# EAGLE schematic airlight (EAGLE 6.4)

## Sheet 1 of 3
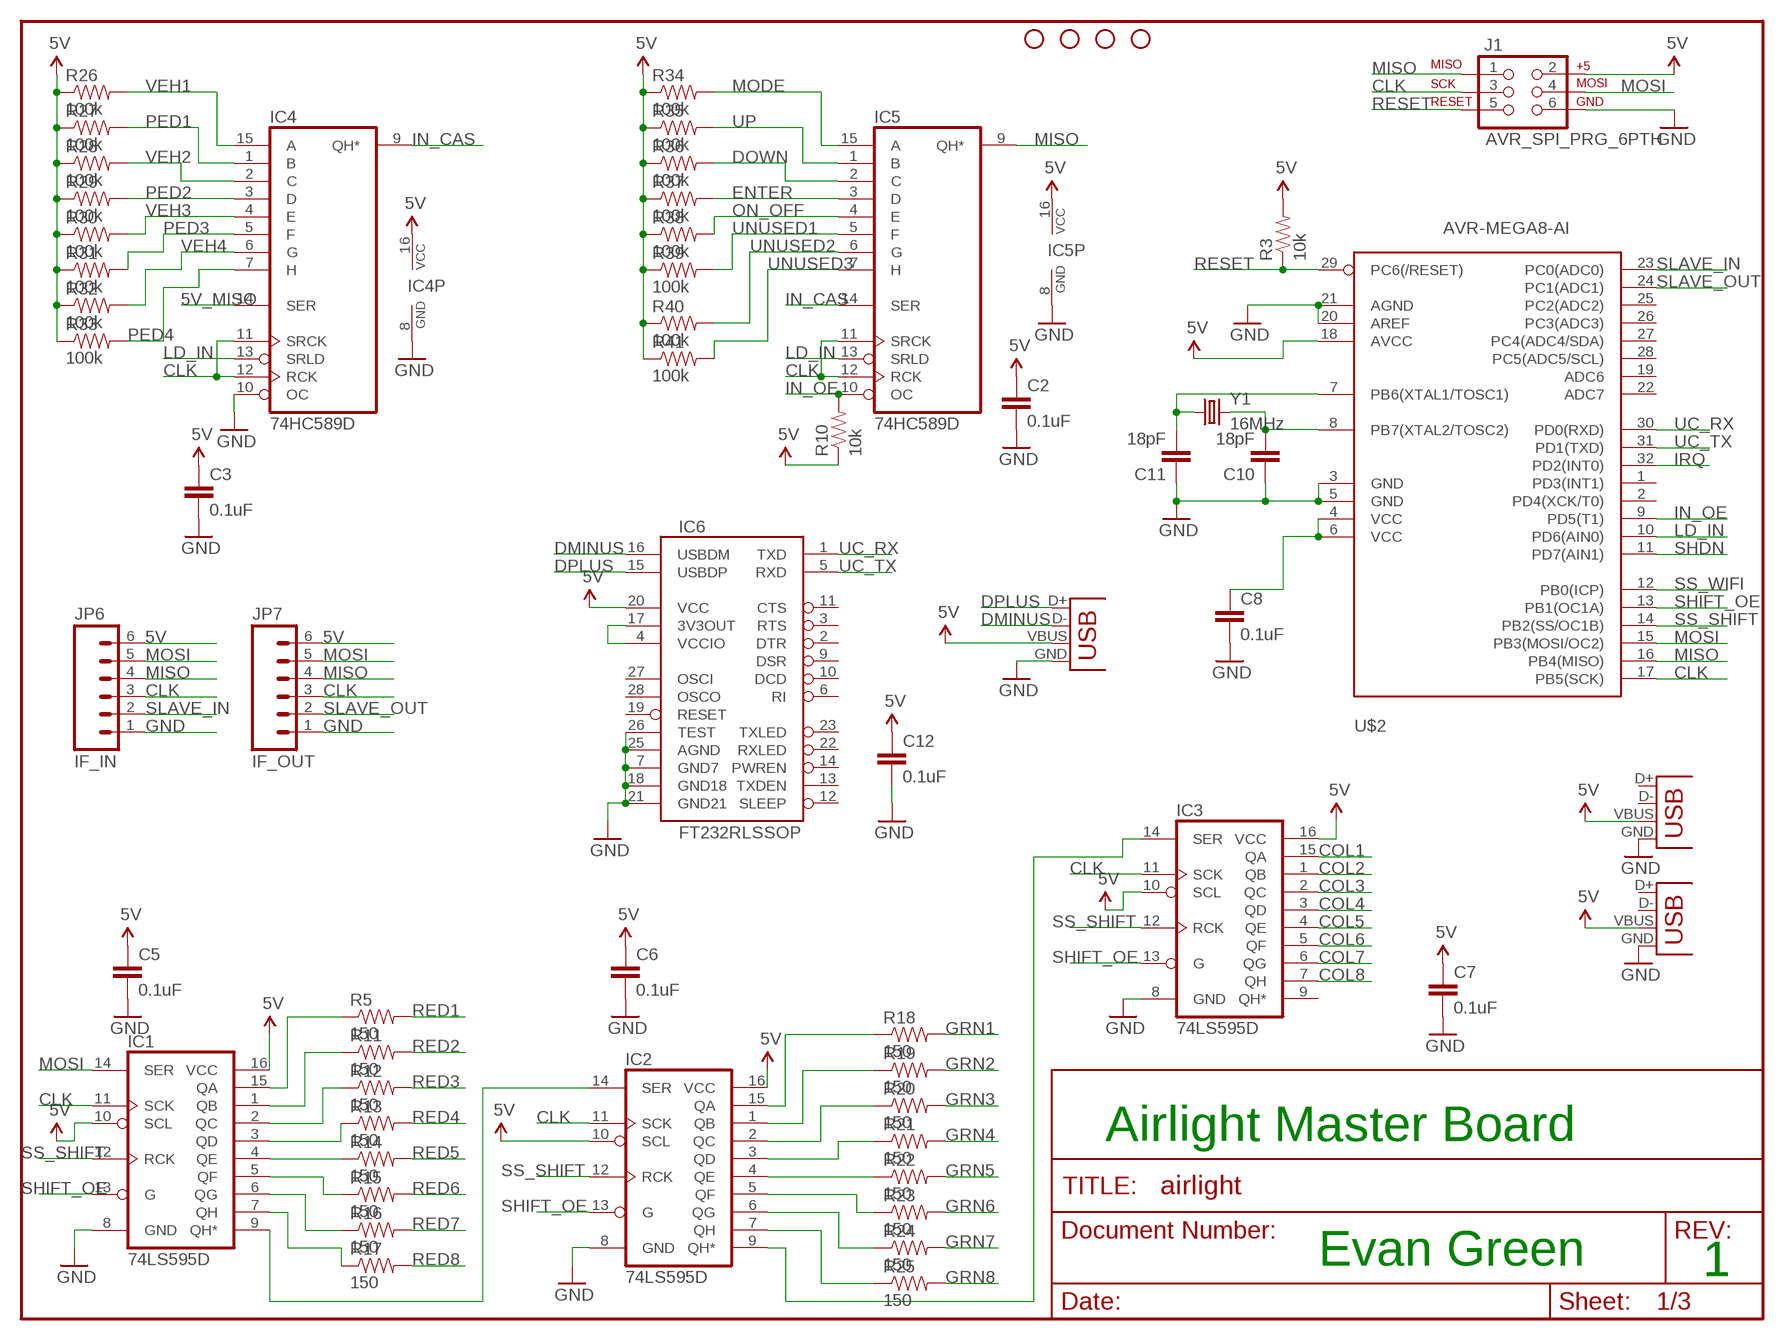
[diagram p0: schematic, sheet 1]

### Parts
C2  0.1uF  CAP0402-CAP  [0402-CAP]
C3  0.1uF  CAP0402-CAP  [0402-CAP]
C5  0.1uF  CAP0402-CAP  [0402-CAP]
C6  0.1uF  CAP0402-CAP  [0402-CAP]
C7  0.1uF  CAP0402-CAP  [0402-CAP]
C8  0.1uF  CAP0402-CAP  [0402-CAP]
C10  18pF  CAP0402-CAP  [0402-CAP]
C11  18pF  CAP0402-CAP  [0402-CAP]
C12  0.1uF  CAP0402-CAP  [0402-CAP]
IC1  74LS595D  [SO16]
IC2  74LS595D  [SO16]
IC3  74LS595D  [SO16]
IC4  74HC589D  [SO16]
IC5  74HC589D  [SO16]
IC6  FT232RLSSOP  [SSOP28DB]
J1  AVR_SPI_PRG_6PTH  [2X3]
JP2  STAND-OFF  [STAND-OFF]
JP3  STAND-OFF  [STAND-OFF]
JP4  STAND-OFF  [STAND-OFF]
JP5  STAND-OFF  [STAND-OFF]
JP6  IF_IN  M06SIP  [1X06]
JP7  IF_OUT  M06SIP  [1X06]
R3  10k  RESISTOR0402-RES  [0402-RES]
R5  150  RESISTOR0402-RES  [0402-RES]
R10  10k  RESISTOR0402-RES  [0402-RES]
R11  150  RESISTOR0402-RES  [0402-RES]
R12  150  RESISTOR0402-RES  [0402-RES]
R13  150  RESISTOR0402-RES  [0402-RES]
R14  150  RESISTOR0402-RES  [0402-RES]
R15  150  RESISTOR0402-RES  [0402-RES]
R16  150  RESISTOR0402-RES  [0402-RES]
R17  150  RESISTOR0402-RES  [0402-RES]
R18  150  RESISTOR0402-RES  [0402-RES]
R19  150  RESISTOR0402-RES  [0402-RES]
R20  150  RESISTOR0402-RES  [0402-RES]
R21  150  RESISTOR0402-RES  [0402-RES]
R22  150  RESISTOR0402-RES  [0402-RES]
R23  150  RESISTOR0402-RES  [0402-RES]
R24  150  RESISTOR0402-RES  [0402-RES]
R25  150  RESISTOR0402-RES  [0402-RES]
R26  100k  RESISTOR0402-RES  [0402-RES]
R27  100k  RESISTOR0402-RES  [0402-RES]
R28  100k  RESISTOR0402-RES  [0402-RES]
R29  100k  RESISTOR0402-RES  [0402-RES]
R30  100k  RESISTOR0402-RES  [0402-RES]
R31  100k  RESISTOR0402-RES  [0402-RES]
R32  100k  RESISTOR0402-RES  [0402-RES]
R33  100k  RESISTOR0402-RES  [0402-RES]
R34  100k  RESISTOR0402-RES  [0402-RES]
R35  100k  RESISTOR0402-RES  [0402-RES]
R36  100k  RESISTOR0402-RES  [0402-RES]
R37  100k  RESISTOR0402-RES  [0402-RES]
R38  100k  RESISTOR0402-RES  [0402-RES]
R39  100k  RESISTOR0402-RES  [0402-RES]
R40  100k  RESISTOR0402-RES  [0402-RES]
R41  100k  RESISTOR0402-RES  [0402-RES]
U$2  AVR-MEGA8-AI  [TQFP32-08]
X1  USBSMD  [USB-MINIB]
X2  USBSMD  [USB-MINIB]
X3  USBSMD  [USB-MINIB]
Y1  16MHz  CRYSTALHC49US  [HC49US]

### Nets
5V: C2.1 C3.1 C5.1 C6.1 C7.1 C12.1 IC1.10(SCL) IC1.16(VCC) IC2.10(SCL) IC2.16(VCC) IC3.10(SCL) IC3.16(VCC) IC4.16(VCC) IC5.16(VCC) IC6.20(VCC) J1.2 JP6.6 JP7.6 R3.2 R10.1 R26.1 R27.1 R28.1 R29.1 R30.1 R31.1 R32.1 R33.1 R34.1 R35.1 R36.1 R37.1 R38.1 R39.1 R40.1 R41.1 U$2.18(AVCC) X1.VBUS X2.VBUS X3.VBUS ; also sheet 3
5V_MISO: IC4.14(SER) ; also sheet 3
CLK: IC1.11(SCK) IC2.11(SCK) IC3.11(SCK) IC4.11(SRCK) IC4.12(RCK) IC5.11(SRCK) IC5.12(RCK) J1.3 JP6.3 JP7.3 U$2.17(PB5(SCK)) ; also sheet 3
COL1: IC3.15(QA) ; also sheet 2
COL2: IC3.1(QB) ; also sheet 2
COL3: IC3.2(QC) ; also sheet 2
COL4: IC3.3(QD) ; also sheet 2
COL5: IC3.4(QE) ; also sheet 2
COL6: IC3.5(QF) ; also sheet 2
COL7: IC3.6(QG) ; also sheet 2
COL8: IC3.7(QH) ; also sheet 2
DMINUS: IC6.16(USBDM) X1.D-
DOWN: IC5.2(C) R36.2 ; also sheet 3
DPLUS: IC6.15(USBDP) X1.D+
ENTER: IC5.3(D) R37.2 ; also sheet 3
GND: C2.2 C3.2 C5.2 C6.2 C7.2 C8.2 C10.1 C11.1 C12.2 IC1.8(GND) IC2.8(GND) IC3.8(GND) IC4.8(GND) IC4.10(OC) IC5.8(GND) IC6.7(GND7) IC6.18(GND18) IC6.21(GND21) IC6.25(AGND) IC6.26(TEST) J1.6 JP6.1 JP7.1 U$2.3(GND) U$2.5(GND) U$2.20(AREF) U$2.21(AGND) X1.GND X2.GND X3.GND ; also sheet 3
GRN1: R18.2 ; also sheet 2
GRN2: R19.2 ; also sheet 2
GRN3: R20.2 ; also sheet 2
GRN4: R21.2 ; also sheet 2
GRN5: R22.2 ; also sheet 2
GRN6: R23.2 ; also sheet 2
GRN7: R24.2 ; also sheet 2
GRN8: R25.2 ; also sheet 2
IN_CAS: IC4.9(QH*) IC5.14(SER)
IN_OE: IC5.10(OC) R10.2 U$2.9(PD5(T1))
IRQ: U$2.32(PD2(INT0)) ; also sheet 3
LD_IN: IC4.13(SRLD) IC5.13(SRLD) U$2.10(PD6(AIN0))
MISO: IC5.9(QH*) J1.1 JP6.4 JP7.4 U$2.16(PB4(MISO))
MODE: IC5.15(A) R34.2 ; also sheet 3
MOSI: IC1.14(SER) J1.4 JP6.5 JP7.5 U$2.15(PB3(MOSI/OC2)) ; also sheet 3
N$1: IC1.15(QA) R5.1
N$2: IC1.1(QB) R11.1
N$3: IC1.2(QC) R12.1
N$4: IC1.3(QD) R13.1
N$5: IC1.4(QE) R14.1
N$6: IC1.5(QF) R15.1
N$7: IC1.6(QG) R16.1
N$8: IC1.7(QH) R17.1
N$11: C11.2 U$2.7(PB6(XTAL1/TOSC1)) Y1.1
N$12: C10.2 U$2.8(PB7(XTAL2/TOSC2)) Y1.2
N$13: IC2.15(QA) R18.1
N$14: IC2.1(QB) R19.1
N$15: IC2.2(QC) R20.1
N$16: IC2.3(QD) R21.1
N$17: IC2.4(QE) R22.1
N$18: IC2.5(QF) R23.1
N$19: IC2.6(QG) R24.1
N$20: IC2.7(QH) R25.1
N$21: IC6.4(VCCIO) IC6.17(3V3OUT)
N$27: IC2.9(QH*) IC3.14(SER)
N$31: C8.1 U$2.4(VCC) U$2.6(VCC)
N$32: IC1.9(QH*) IC2.14(SER)
ON_OFF: IC5.4(E) R38.2 ; also sheet 3
PED1: IC4.1(B) R27.2 ; also sheet 3
PED2: IC4.3(D) R29.2 ; also sheet 3
PED3: IC4.5(F) R31.2 ; also sheet 3
PED4: IC4.7(H) R33.2 ; also sheet 3
RED1: R5.2 ; also sheet 2
RED2: R11.2 ; also sheet 2
RED3: R12.2 ; also sheet 2
RED4: R13.2 ; also sheet 2
RED5: R14.2 ; also sheet 2
RED6: R15.2 ; also sheet 2
RED7: R16.2 ; also sheet 2
RED8: R17.2 ; also sheet 2
RESET: J1.5 R3.1 U$2.29(PC6(/RESET))
SHDN: U$2.11(PD7(AIN1)) ; also sheet 3
SHIFT_OE: IC1.13(G) IC2.13(G) IC3.13(G) U$2.13(PB1(OC1A))
SLAVE_IN: JP6.2 U$2.23(PC0(ADC0))
SLAVE_OUT: JP7.2 U$2.24(PC1(ADC1))
SS_SHIFT: IC1.12(RCK) IC2.12(RCK) IC3.12(RCK) U$2.14(PB2(SS/OC1B))
SS_WIFI: U$2.12(PB0(ICP)) ; also sheet 3
UC_RX: IC6.1(TXD) U$2.30(PD0(RXD))
UC_TX: IC6.5(RXD) U$2.31(PD1(TXD))
UNUSED1: IC5.5(F) R39.2
UNUSED2: IC5.6(G) R40.2
UNUSED3: IC5.7(H) R41.2
UP: IC5.1(B) R35.2 ; also sheet 3
VEH1: IC4.15(A) R26.2 ; also sheet 3
VEH2: IC4.2(C) R28.2 ; also sheet 3
VEH3: IC4.4(E) R30.2 ; also sheet 3
VEH4: IC4.6(G) R32.2 ; also sheet 3
Unconnected: IC3.9(QH*) IC6.2(DTR) IC6.3(RTS) IC6.6(RI) IC6.9(DSR) IC6.10(DCD) IC6.11(CTS) IC6.12(SLEEP) IC6.13(TXDEN) IC6.14(PWREN) IC6.19(RESET) IC6.22(RXLED) IC6.23(TXLED) IC6.27(OSCI) IC6.28(OSCO) U$2.1(PD3(INT1)) U$2.2(PD4(XCK/T0)) U$2.19(ADC6) U$2.22(ADC7) U$2.25(PC2(ADC2)) U$2.26(PC3(ADC3)) U$2.27(PC4(ADC4/SDA)) U$2.28(PC5(ADC5/SCL)) X2.D+ X2.D- X3.D+ X3.D-

### Notes on the sheet
- Airlight Master Board
- Evan Green | 1

## Sheet 2 of 3
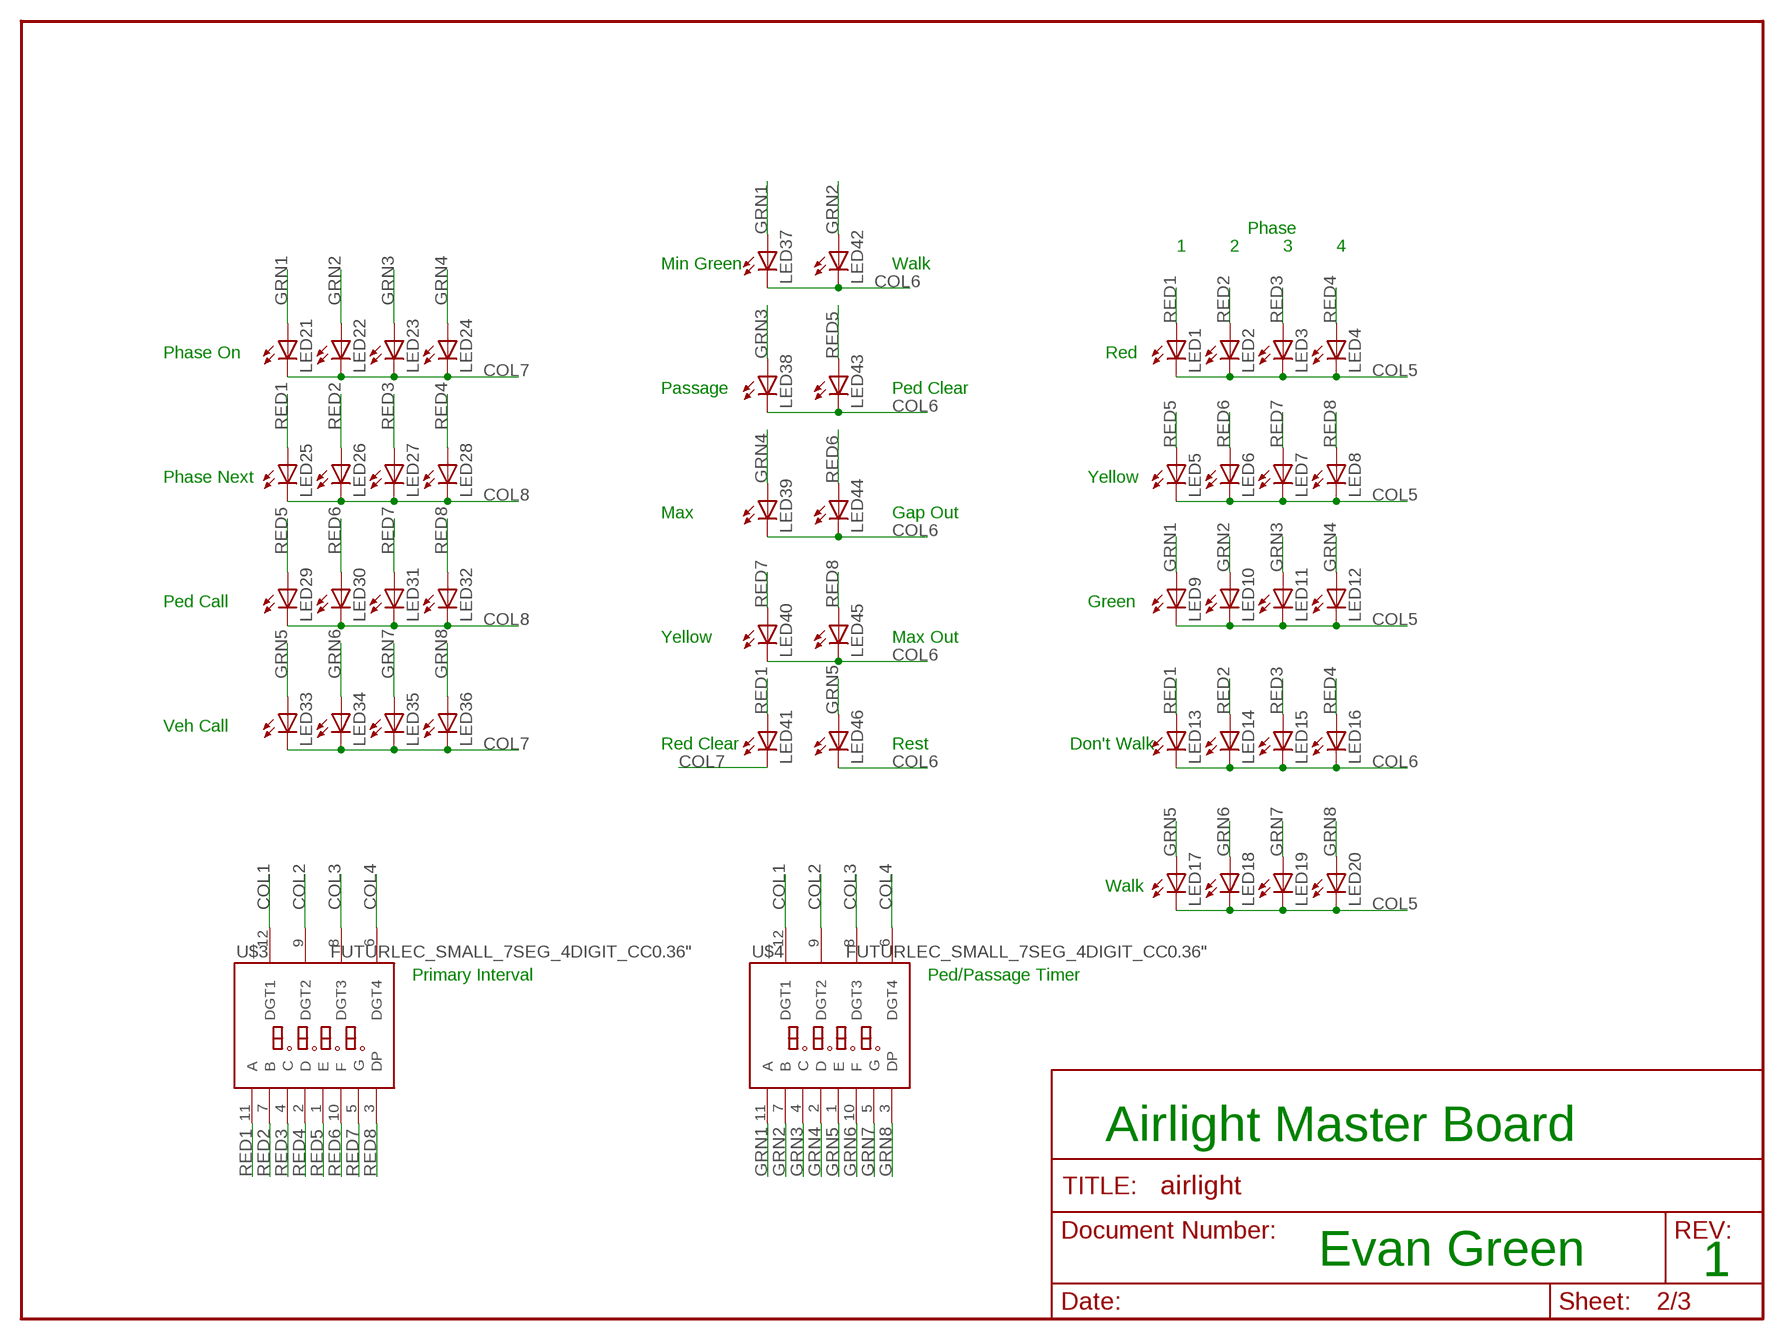
[diagram p1: schematic, sheet 2]

### Parts
LED1  LED5MM  [LED5MM]
LED2  LED5MM  [LED5MM]
LED3  LED5MM  [LED5MM]
LED4  LED5MM  [LED5MM]
LED5  LED5MM  [LED5MM]
LED6  LED5MM  [LED5MM]
LED7  LED5MM  [LED5MM]
LED8  LED5MM  [LED5MM]
LED9  LED5MM  [LED5MM]
LED10  LED5MM  [LED5MM]
LED11  LED5MM  [LED5MM]
LED12  LED5MM  [LED5MM]
LED13  LED5MM  [LED5MM]
LED14  LED5MM  [LED5MM]
LED15  LED5MM  [LED5MM]
LED16  LED5MM  [LED5MM]
LED17  LED5MM  [LED5MM]
LED18  LED5MM  [LED5MM]
LED19  LED5MM  [LED5MM]
LED20  LED5MM  [LED5MM]
LED21  LED5MM  [LED5MM]
LED22  LED5MM  [LED5MM]
LED23  LED5MM  [LED5MM]
LED24  LED5MM  [LED5MM]
LED25  LED5MM  [LED5MM]
LED26  LED5MM  [LED5MM]
LED27  LED5MM  [LED5MM]
LED28  LED5MM  [LED5MM]
LED29  LED5MM  [LED5MM]
LED30  LED5MM  [LED5MM]
LED31  LED5MM  [LED5MM]
LED32  LED5MM  [LED5MM]
LED33  LED5MM  [LED5MM]
LED34  LED5MM  [LED5MM]
LED35  LED5MM  [LED5MM]
LED36  LED5MM  [LED5MM]
LED37  LED5MM  [LED5MM]
LED38  LED5MM  [LED5MM]
LED39  LED5MM  [LED5MM]
LED40  LED5MM  [LED5MM]
LED41  LED5MM  [LED5MM]
LED42  LED5MM  [LED5MM]
LED43  LED5MM  [LED5MM]
LED44  LED5MM  [LED5MM]
LED45  LED5MM  [LED5MM]
LED46  LED5MM  [LED5MM]
U$3  FUTURLEC_SMALL_7SEG_4DIGIT_CC0.36"  [FUTURLEC_SMALL_7SEG_4DIGIT_CC]
U$4  FUTURLEC_SMALL_7SEG_4DIGIT_CC0.36"  [FUTURLEC_SMALL_7SEG_4DIGIT_CC]

### Nets
COL1: U$3.12(DGT1) U$4.12(DGT1) ; also sheet 1
COL2: U$3.9(DGT2) U$4.9(DGT2) ; also sheet 1
COL3: U$3.8(DGT3) U$4.8(DGT3) ; also sheet 1
COL4: U$3.6(DGT4) U$4.6(DGT4) ; also sheet 1
COL5: LED1.K(C) LED2.K(C) LED3.K(C) LED4.K(C) LED5.K(C) LED6.K(C) LED7.K(C) LED8.K(C) LED9.K(C) LED10.K(C) LED11.K(C) LED12.K(C) LED17.K(C) LED18.K(C) LED19.K(C) LED20.K(C) ; also sheet 1
COL6: LED13.K(C) LED14.K(C) LED15.K(C) LED16.K(C) LED37.K(C) LED38.K(C) LED39.K(C) LED40.K(C) LED42.K(C) LED43.K(C) LED44.K(C) LED45.K(C) LED46.K(C) ; also sheet 1
COL7: LED21.K(C) LED22.K(C) LED23.K(C) LED24.K(C) LED33.K(C) LED34.K(C) LED35.K(C) LED36.K(C) LED41.K(C) ; also sheet 1
COL8: LED25.K(C) LED26.K(C) LED27.K(C) LED28.K(C) LED29.K(C) LED30.K(C) LED31.K(C) LED32.K(C) ; also sheet 1
GRN1: LED9.A LED21.A LED37.A U$4.11(A) ; also sheet 1
GRN2: LED10.A LED22.A LED42.A U$4.7(B) ; also sheet 1
GRN3: LED11.A LED23.A LED38.A U$4.4(C) ; also sheet 1
GRN4: LED12.A LED24.A LED39.A U$4.2(D) ; also sheet 1
GRN5: LED17.A LED33.A LED46.A U$4.1(E) ; also sheet 1
GRN6: LED18.A LED34.A U$4.10(F) ; also sheet 1
GRN7: LED19.A LED35.A U$4.5(G) ; also sheet 1
GRN8: LED20.A LED36.A U$4.3(DP) ; also sheet 1
RED1: LED1.A LED13.A LED25.A LED41.A U$3.11(A) ; also sheet 1
RED2: LED2.A LED14.A LED26.A U$3.7(B) ; also sheet 1
RED3: LED3.A LED15.A LED27.A U$3.4(C) ; also sheet 1
RED4: LED4.A LED16.A LED28.A U$3.2(D) ; also sheet 1
RED5: LED5.A LED29.A LED43.A U$3.1(E) ; also sheet 1
RED6: LED6.A LED30.A LED44.A U$3.10(F) ; also sheet 1
RED7: LED7.A LED31.A LED40.A U$3.5(G) ; also sheet 1
RED8: LED8.A LED32.A LED45.A U$3.3(DP) ; also sheet 1

### Notes on the sheet
- Phase
- 1 | 2 | 3 | 4
- Min Green | Walk
- Phase On | Red
- Passage | Ped Clear
- Phase Next | Yellow
- Max | Gap Out
- Ped Call | Green
- Yellow | Max Out
- Veh Call
- Red Clear | Rest | Don't Walk
- Walk
- Primary Interval | Ped/Passage Timer
- Airlight Master Board
- Evan Green | 1

## Sheet 3 of 3
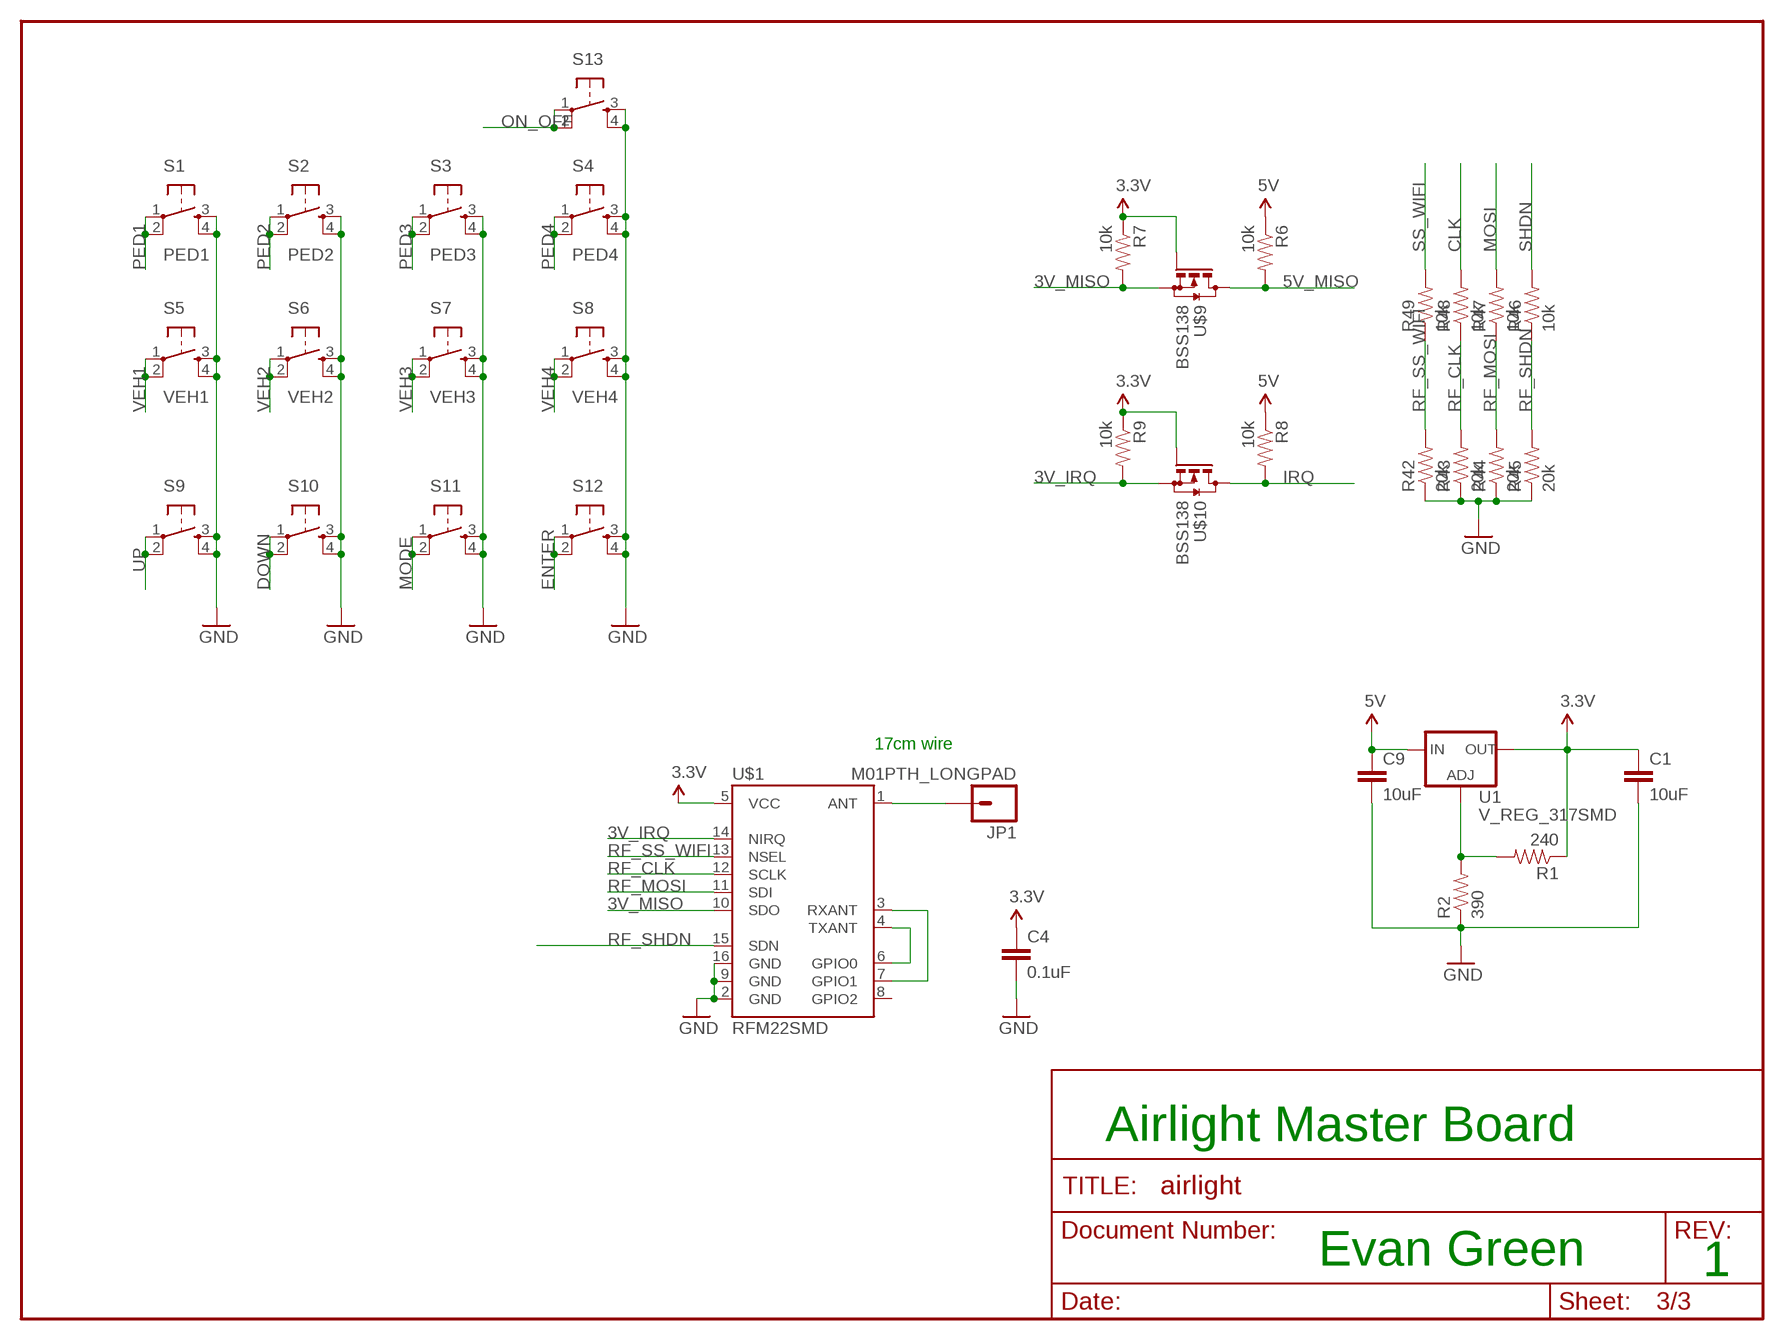
[diagram p2: schematic, sheet 3]

### Parts
C1  10uF  CAP0805  [0805]
C4  0.1uF  CAP0402-CAP  [0402-CAP]
C9  10uF  CAP0805  [0805]
JP1  M01PTH_LONGPAD  [1X01_LONGPAD]
R1  240  RESISTOR0402-RES  [0402-RES]
R2  390  RESISTOR0402-RES  [0402-RES]
R6  10k  RESISTOR0402-RES  [0402-RES]
R7  10k  RESISTOR0402-RES  [0402-RES]
R8  10k  RESISTOR0402-RES  [0402-RES]
R9  10k  RESISTOR0402-RES  [0402-RES]
R42  20k  RESISTOR0402-RES  [0402-RES]
R43  20k  RESISTOR0402-RES  [0402-RES]
R44  20k  RESISTOR0402-RES  [0402-RES]
R45  20k  RESISTOR0402-RES  [0402-RES]
R46  10k  RESISTOR0402-RES  [0402-RES]
R47  10k  RESISTOR0402-RES  [0402-RES]
R48  10k  RESISTOR0402-RES  [0402-RES]
R49  10k  RESISTOR0402-RES  [0402-RES]
S1  PED1  TAC_SWITCHPTH  [TACTILE-PTH]
S2  PED2  TAC_SWITCHPTH  [TACTILE-PTH]
S3  PED3  TAC_SWITCHPTH  [TACTILE-PTH]
S4  PED4  TAC_SWITCHPTH  [TACTILE-PTH]
S5  VEH1  TAC_SWITCHPTH  [TACTILE-PTH]
S6  VEH2  TAC_SWITCHPTH  [TACTILE-PTH]
S7  VEH3  TAC_SWITCHPTH  [TACTILE-PTH]
S8  VEH4  TAC_SWITCHPTH  [TACTILE-PTH]
S9  TAC_SWITCHPTH  [TACTILE-PTH]
S10  TAC_SWITCHPTH  [TACTILE-PTH]
S11  TAC_SWITCHPTH  [TACTILE-PTH]
S12  TAC_SWITCHPTH  [TACTILE-PTH]
S13  TAC_SWITCHPTH  [TACTILE-PTH]
U1  V_REG_317SMD  [SOT223]
U$1  RFM22SMD  [RFM22-XXX-S2]
U$9  BSS138  [SOT-323]
U$10  BSS138  [SOT-323]

### Nets
3.3V: C1.1 C4.1 R1.1 R7.1 R9.1 U1.2(OUT) U$1.5(VCC) U$9.1(G) U$10.1(G)
3V_IRQ: R9.2 U$1.14(NIRQ) U$10.2(S)
3V_MISO: R7.2 U$1.10(SDO) U$9.2(S)
5V: C9.1 R6.1 R8.1 U1.3(IN) ; also sheet 1
5V_MISO: R6.2 U$9.3(D) ; also sheet 1
CLK: R48.2 ; also sheet 1
DOWN: S10.1 S10.2 ; also sheet 1
ENTER: S12.1 S12.2 ; also sheet 1
GND: C1.2 C4.2 C9.2 R2.1 R42.1 R43.1 R44.1 R45.1 S1.3 S1.4 S2.3 S2.4 S3.3 S3.4 S4.3 S4.4 S5.3 S5.4 S6.3 S6.4 S7.3 S7.4 S8.3 S8.4 S9.3 S9.4 S10.3 S10.4 S11.3 S11.4 S12.3 S12.4 S13.3 S13.4 U$1.2(GND) U$1.9(GND) U$1.16(GND) ; also sheet 1
IRQ: R8.2 U$10.3(D) ; also sheet 1
MODE: S11.1 S11.2 ; also sheet 1
MOSI: R47.2 ; also sheet 1
N$9: U$1.4(TXANT) U$1.6(GPIO0)
N$10: R1.2 R2.2 U1.1(ADJ)
N$22: U$1.3(RXANT) U$1.7(GPIO1)
N$23: JP1.1 U$1.1(ANT)
ON_OFF: S13.1 S13.2 ; also sheet 1
PED1: S1.1 S1.2 ; also sheet 1
PED2: S2.1 S2.2 ; also sheet 1
PED3: S3.1 S3.2 ; also sheet 1
PED4: S4.1 S4.2 ; also sheet 1
RF_CLK: R43.2 R48.1 U$1.12(SCLK)
RF_MOSI: R44.2 R47.1 U$1.11(SDI)
RF_SHDN: R45.2 R46.1 U$1.15(SDN)
RF_SS_WIFI: R42.2 R49.1 U$1.13(NSEL)
SHDN: R46.2 ; also sheet 1
SS_WIFI: R49.2 ; also sheet 1
UP: S9.1 S9.2 ; also sheet 1
VEH1: S5.1 S5.2 ; also sheet 1
VEH2: S6.1 S6.2 ; also sheet 1
VEH3: S7.1 S7.2 ; also sheet 1
VEH4: S8.1 S8.2 ; also sheet 1
Unconnected: U$1.8(GPIO2)

### Notes on the sheet
- 17cm wire
- Airlight Master Board
- Evan Green | 1

## Library data of the parts
C1-C12 = SparkFun:CAP: Capacitor Standard 0603 ceramic capacitor, and 0.1" leaded capacitor.
IC1-IC3 = SparkFun:74*595: 8-bit SHIFT REGISTER, output latch
IC4 IC5 = 74xx-eu:74*589: 8-bit SHIFT REGISTER, input latch, 3-state
IC6 = SparkFun:FT232RL: USB UART FT232RL 4th Generation USB UART (USB <-> Serial) Controller. Spark Fun Electronics SKU : COM-00650
J1 = SparkFun:AVR_SPI_PRG_6: AVR ISP 6 Pin This is the reduced ISP connector for AVR programming. Common on Arduino. This footprint will take up less PCB space and can be used with a 10-pin to 6-pin adapter such as SKU: BOB-08508
JP1 = SparkFun:M01: Header 1 Standard 1-pin 0.1" header. Use with straight break away headers (SKU : PRT-00116), right angle break away headers (PRT-00553), swiss pins (PRT-00743), machine pins (PRT-00117), and female headers (PRT-00115).
JP2-JP5 = SparkFun:STAND-OFF: Stand Off This is the mechanical footprint for a #4 phillips button head screw. Use the keepout ring to avoid running the screw head into surrounding components. SKU : PRT-00447
JP6 JP7 = SparkFun:M06: Header 6 Standard 6-pin 0.1" header. Use with straight break away headers (SKU : PRT-00116), right angle break away headers (PRT-00553), swiss pins (PRT-00743), machine pins (PRT-00117), and female headers (PRT-00115). Molex polarized connector foot print use with SKU : PRT-08094 with associated crimp pins and housings. NOTES ON THE VARIANTS LOCK and LOCK_LONGPADS... This footprint was designed to help hold the alignment of a through-hole component (i.e. 6-pin header) while soldering it into place. You may notice that each hole has been shifted either up or down by 0.005 of an inch from it's more standard position (which is a perfectly straight line). This slight alteration caused the pins (the squares in the middle) to touch the edges of the holes. Because they are alternating, it causes a "brace" to hold the component in place. 0.005 has proven to be the perfect amount of "off-center" position when using our standard breakaway headers. Although looks a little odd when you look at the bare footprint, once you have a header in there, the alteration is very hard to notice. Also, if you push a header all the way into place, it is covered up entirely on the bottom side. This idea of altering the position of holes to aid alignment will be further integrated into the Sparkfun Library for other footprints. It can help hold any component with 3 or more connection pins.
LED1-LED46 = SparkFun:LED: LEDs Standard schematic elements and footprints for 5mm, 3mm, 1206, and 0603 sized LEDs. 5mm - Spark Fun Electronics SKU : COM-00529 (and others)
R1-R3 R5-R49 = SparkFun:RESISTOR: Resistor Basic schematic elements and footprints for 0603, 1206, and PTH resistors.
S1-S13 = SparkFun:TAC_SWITCH: Momentary Switch Button commonly used for reset or general input. Spark Fun Electronics SKU : COM-00097
U1 = SparkFun:V_REG_317: Voltage Regulator Standard LM317 adjustable voltage regulator. AOI (Adjust Output Input). Google 'LM317 Calculator' for easy to use app to get the two resistor values needed. 240/720 for 5V output. 240/390 for 3.3V output. Spark Fun Electronics SKU : COM-00527
U$1 = SparkFun:RFM22: Description: The RFM22 is a low-power, low cost radio that is capable of operating in the 434MHz and 900MHz open bands. It's frequency is software defined and there are some very good libraries written for it.
U$2 = SparkFun:AVR-MEGA8: MICROCONTROLLER 8 Kbytes FLASH 1 kbytes SRAM 512 bytes EEPROM USART 6-channel 10 bit ADC 2-channel 8 bit ADC
U$3 U$4 = Evan:FUTURLEC_SMALL_7SEG_4DIGIT_CC: Futurlec 0.36" Common Cathode 4-Digit 7-Segment LED Display
U$9 U$10 = Evan:BSS138: BSS138W N-MOSFET Evan Green 7-Aug-2012
X1-X3 = SparkFun:USB: USB Connectors USB-B-PTH is fully proven SKU : PRT-00139 USB-miniB is fully proven SKU : PRT-00587 USB-A-PCB is untested. USB-A-H is throughly reviewed, but untested. Spark Fun Electronics SKU : PRT-00437 USB-B-SMT is throughly reviewed, but untested. Needs silkscreen touching up. USB-A-S has not been used/tested USB-MB-H has not been used/tested
Y1 = SparkFun:CRYSTAL: Crystals Various standard crystals. Proven footprints. Spark Fun Electronics SKU : COM-00534